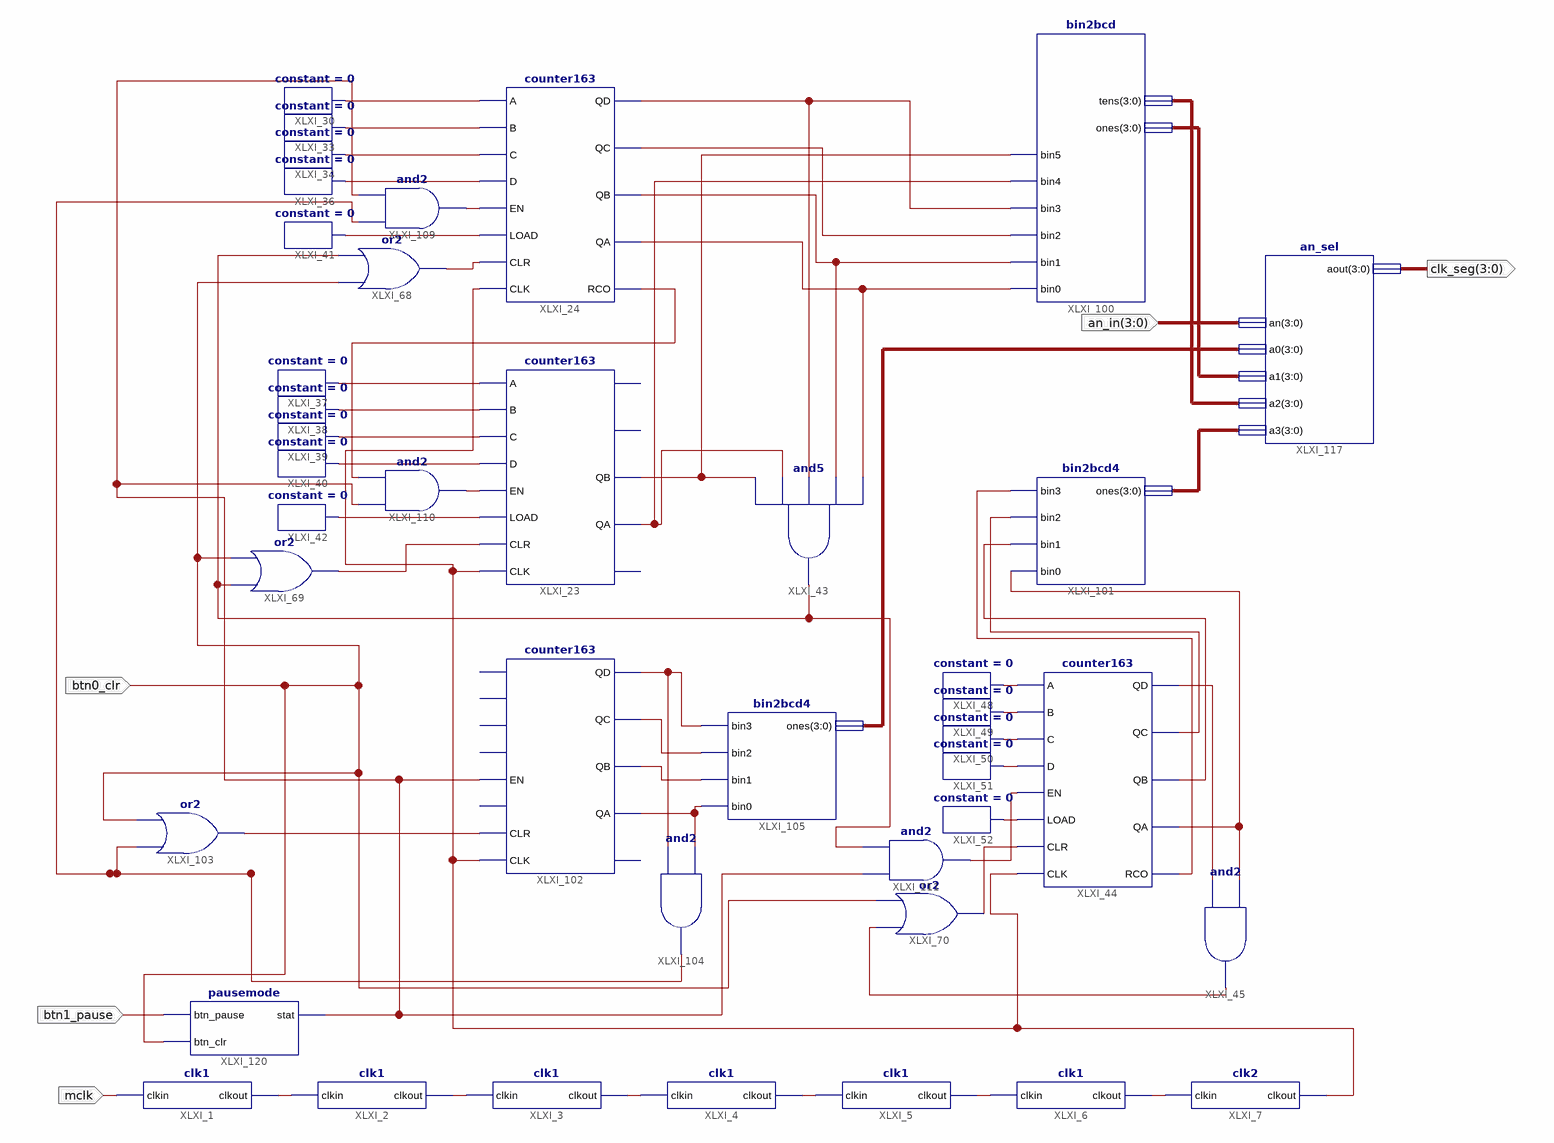
[diagram p0: schematic sheet 1]
// Xilinx ISE schematic sclk.sch (spartan3e) as structural Verilog: 41 symbols, 5 ports
module sclk (
  input  btn0_clr,
  input  btn1_pause,
  input  mclk,
  input  [3:0] an_in,
  output [3:0] clk_seg
);

  wire XLXN_1, XLXN_2, XLXN_3, XLXN_4, XLXN_5, XLXN_6, XLXN_38, XLXN_39, XLXN_40, XLXN_41, XLXN_42, XLXN_43,
       XLXN_44, XLXN_45, XLXN_46, XLXN_47, XLXN_51, XLXN_55, XLXN_56, XLXN_57, XLXN_58, XLXN_60, XLXN_66,
       XLXN_69, XLXN_106, XLXN_115, XLXN_117, XLXN_118, XLXN_119, XLXN_120, XLXN_151, XLXN_176, XLXN_177,
       XLXN_178, XLXN_179, XLXN_181, XLXN_184, XLXN_203, XLXN_206, XLXN_208, XLXN_209, XLXN_210, XLXN_211,
       XLXN_213, XLXN_214, XLXN_215, XLXN_216, XLXN_217, XLXN_218;
  wire [3:0] XLXN_188, XLXN_189, XLXN_190, XLXN_191;

  clk2 XLXI_7 (.clkin(XLXN_6), .clkout(XLXN_203));
  clk1 XLXI_6 (.clkin(XLXN_5), .clkout(XLXN_6));
  clk1 XLXI_5 (.clkin(XLXN_4), .clkout(XLXN_5));
  clk1 XLXI_4 (.clkin(XLXN_3), .clkout(XLXN_4));
  clk1 XLXI_3 (.clkin(XLXN_2), .clkout(XLXN_3));
  clk1 XLXI_2 (.clkin(XLXN_1), .clkout(XLXN_2));
  clk1 XLXI_1 (.clkin(mclk), .clkout(XLXN_1));
  counter163 XLXI_44 (
    .A(XLXN_55), .B(XLXN_56), .C(XLXN_57), .D(XLXN_58), .EN(XLXN_181), .LOAD(XLXN_60), .CLR(XLXN_69),
    .CLK(XLXN_203), .RCO(XLXN_120), .QC(XLXN_119), .QD(XLXN_51), .QA(XLXN_117), .QB(XLXN_118));
  and XLXI_45 (XLXN_115, XLXN_51, XLXN_117);
  constant #(.CValue("0")) XLXI_48 (.O(XLXN_55));
  constant #(.CValue("0")) XLXI_49 (.O(XLXN_56));
  constant #(.CValue("0")) XLXI_50 (.O(XLXN_57));
  constant #(.CValue("0")) XLXI_51 (.O(XLXN_58));
  constant #(.CValue("0")) XLXI_52 (.O(XLXN_60));
  or XLXI_70 (XLXN_69, XLXN_115, btn0_clr);
  bin2bcd XLXI_100 (
    .tens(XLXN_190), .ones(XLXN_189), .bin5(XLXN_213), .bin4(XLXN_214), .bin3(XLXN_215), .bin2(XLXN_216),
    .bin1(XLXN_217), .bin0(XLXN_218));
  bin2bcd4 XLXI_101 (.bin3(XLXN_120), .bin2(XLXN_119), .bin1(XLXN_118), .bin0(XLXN_117), .ones(XLXN_191));
  or XLXI_69 (XLXN_106, XLXN_184, btn0_clr);
  or XLXI_68 (XLXN_66, btn0_clr, XLXN_184);
  counter163 XLXI_24 (
    .A(XLXN_38), .B(XLXN_39), .C(XLXN_40), .D(XLXN_41), .EN(XLXN_177), .LOAD(XLXN_46), .CLR(XLXN_66),
    .CLK(XLXN_203), .RCO(XLXN_179), .QC(XLXN_216), .QD(XLXN_215), .QA(XLXN_218), .QB(XLXN_217));
  and XLXI_43 (XLXN_184, XLXN_213, XLXN_214, XLXN_215, XLXN_217, XLXN_218);
  counter163 XLXI_23 (
    .A(XLXN_42), .B(XLXN_43), .C(XLXN_44), .D(XLXN_45), .EN(XLXN_178), .LOAD(XLXN_47), .CLR(XLXN_106),
    .CLK(XLXN_203), .QA(XLXN_214), .QB(XLXN_213));  // open: RCO, QC, QD
  constant #(.CValue("0")) XLXI_41 (.O(XLXN_46));
  constant #(.CValue("0")) XLXI_36 (.O(XLXN_41));
  constant #(.CValue("0")) XLXI_34 (.O(XLXN_40));
  constant #(.CValue("0")) XLXI_33 (.O(XLXN_39));
  constant #(.CValue("0")) XLXI_30 (.O(XLXN_38));
  constant #(.CValue("0")) XLXI_38 (.O(XLXN_43));
  constant #(.CValue("0")) XLXI_37 (.O(XLXN_42));
  constant #(.CValue("0")) XLXI_39 (.O(XLXN_44));
  constant #(.CValue("0")) XLXI_40 (.O(XLXN_45));
  constant #(.CValue("0")) XLXI_42 (.O(XLXN_47));
  counter163 XLXI_102 (
    .EN(XLXN_206), .CLR(XLXN_151), .CLK(XLXN_203), .QC(XLXN_211), .QD(XLXN_209), .QA(XLXN_208), .QB(XLXN_210));  // open: A, B, C, D, LOAD, RCO
  or XLXI_103 (XLXN_151, XLXN_176, btn0_clr);
  and XLXI_104 (XLXN_176, XLXN_209, XLXN_208);
  bin2bcd4 XLXI_105 (.bin3(XLXN_209), .bin2(XLXN_211), .bin1(XLXN_210), .bin0(XLXN_208), .ones(XLXN_188));
  and XLXI_109 (XLXN_177, XLXN_176, XLXN_206);
  and XLXI_110 (XLXN_178, XLXN_206, XLXN_179);
  and XLXI_111 (XLXN_181, XLXN_206, XLXN_184);
  an_sel XLXI_117 (.an(an_in), .a0(XLXN_188), .a1(XLXN_189), .a2(XLXN_190), .a3(XLXN_191), .aout(clk_seg));
  pausemode XLXI_120 (.btn_pause(btn1_pause), .btn_clr(btn0_clr), .stat(XLXN_206));
endmodule
